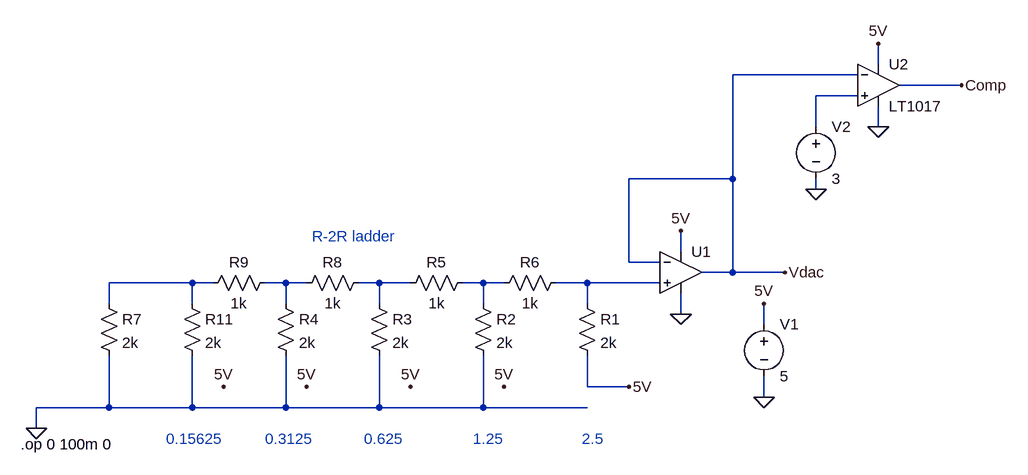
[diagram p0: schematic DAC.asc]
DAC.asc, the LTspice schematic file:
Version 4
SHEET 1 880 680
WIRE 496 -176 496 -208
WIRE 464 -160 272 -160
WIRE 624 -144 528 -144
WIRE 464 -128 400 -128
WIRE 400 -80 400 -128
WIRE 496 -80 496 -112
WIRE 272 0 272 -160
WIRE 272 0 112 0
WIRE 400 16 400 0
WIRE 192 112 192 80
WIRE 112 128 112 0
WIRE 160 128 112 128
WIRE 272 144 272 0
WIRE 272 144 224 144
WIRE 352 144 272 144
WIRE -560 160 -688 160
WIRE -528 160 -560 160
WIRE -416 160 -448 160
WIRE -384 160 -416 160
WIRE -272 160 -304 160
WIRE -224 160 -272 160
WIRE -112 160 -144 160
WIRE -80 160 -112 160
WIRE 48 160 0 160
WIRE 160 160 48 160
WIRE -688 192 -688 160
WIRE -560 192 -560 160
WIRE -416 192 -416 160
WIRE -272 192 -272 160
WIRE -112 192 -112 160
WIRE 48 192 48 160
WIRE 192 208 192 176
WIRE 320 224 320 192
WIRE 48 320 48 272
WIRE 112 320 48 320
WIRE 320 336 320 304
WIRE -688 352 -688 272
WIRE -688 352 -800 352
WIRE -560 352 -560 272
WIRE -560 352 -688 352
WIRE -416 352 -416 272
WIRE -416 352 -560 352
WIRE -272 352 -272 272
WIRE -272 352 -416 352
WIRE -112 352 -112 272
WIRE -112 352 -272 352
WIRE 48 352 -112 352
WIRE -800 384 -800 352
FLAG 192 208 0
FLAG 320 336 0
FLAG 320 192 5V
FLAG 192 80 5V
FLAG 352 144 Vdac
FLAG -800 384 0
FLAG 112 320 5V
FLAG 496 -80 0
FLAG 496 -208 5V
FLAG 400 16 0
FLAG 624 -144 Comp
FLAG -80 320 5V
FLAG -224 320 5V
FLAG -384 320 5V
FLAG -512 320 5V
DATAFLAG 336 -160 ""
DATAFLAG 592 -144 ""
SYMBOL Opamps\\UniversalOpamp2 192 144 R0
SYMATTR InstName U1
SYMBOL voltage 320 208 R0
WINDOW 123 0 0 Left 0
WINDOW 39 0 0 Left 0
SYMATTR InstName V1
SYMATTR Value 5
SYMBOL res 32 176 R0
SYMATTR InstName R1
SYMATTR Value 2k
SYMBOL res -128 176 R0
SYMATTR InstName R2
SYMATTR Value 2k
SYMBOL res -288 176 R0
SYMATTR InstName R3
SYMATTR Value 2k
SYMBOL res -128 144 R90
WINDOW 0 0 56 VBottom 2
WINDOW 3 32 56 VTop 2
SYMATTR InstName R5
SYMATTR Value 1k
SYMBOL res 16 144 R90
WINDOW 0 0 56 VBottom 2
WINDOW 3 32 56 VTop 2
SYMATTR InstName R6
SYMATTR Value 1k
SYMBOL res -432 176 R0
SYMATTR InstName R4
SYMATTR Value 2k
SYMBOL res -704 176 R0
SYMATTR InstName R7
SYMATTR Value 2k
SYMBOL res -288 144 R90
WINDOW 0 0 56 VBottom 2
WINDOW 3 32 56 VTop 2
SYMATTR InstName R8
SYMATTR Value 1k
SYMBOL Comparators\\LT1017 496 -144 R0
SYMATTR InstName U2
SYMBOL voltage 400 -96 R0
WINDOW 123 0 0 Left 0
WINDOW 39 0 0 Left 0
SYMATTR InstName V2
SYMATTR Value 3
SYMBOL res -432 144 R90
WINDOW 0 0 56 VBottom 2
WINDOW 3 32 56 VTop 2
SYMATTR InstName R9
SYMATTR Value 1k
SYMBOL res -576 176 R0
SYMATTR InstName R11
SYMATTR Value 2k
TEXT -824 408 Left 2 !.op 0 100m 0
TEXT 40 400 Left 2 ;2.5
TEXT -128 400 Left 2 ;1.25
TEXT -296 400 Left 2 ;0.625
TEXT -448 400 Left 2 ;0.3125
TEXT -600 400 Left 2 ;0.15625
TEXT -376 88 Left 2 ;R-2R ladder

The netlist it stands for:
* DAC.asc
XU1 N006 Vdac 5V 0 Vdac level.2 Avol=1Meg GBW=10Meg Slew=10Meg ilimit=25m rail=0 Vos=0 phimargin=45 en=0 enk=0 in=0 ink=0 Rin=500Meg  ; pins IN+ IN- V+ V- OUT
V1 5V 0 5
R1 N006 5V 2k
R2 N005 0 2k
R3 N004 0 2k
R5 N005 N004 1k
R6 N006 N005 1k
R4 N003 0 2k
R7 N002 0 2k
R8 N004 N003 1k
XU2 N001 Vdac 5V 0 Comp LT1017  ; pins In+ In- V+ V- OUT
V2 N001 0 3
R9 N003 N002 1k
R11 N002 0 2k
.op 0 100m 0
* 2.5
* 1.25
* 0.625
* 0.3125
* 0.15625
* R-2R ladder
.lib UniversalOpamps2.sub
.backanno
.end